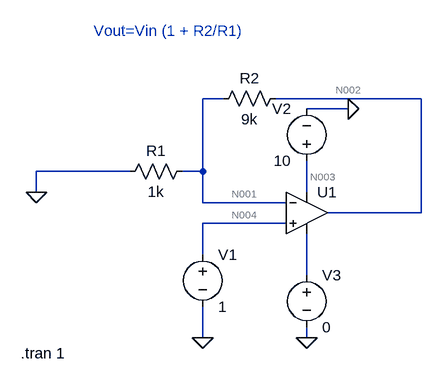
[diagram p0: schematic OPAMP_ORNEK.asc]
OPAMP_ORNEK.asc, the LTspice schematic file:
Version 4
SHEET 1 880 680
WIRE -16 -32 -48 -32
WIRE 288 -32 64 -32
WIRE 176 -16 112 -16
WIRE -160 80 -304 80
WIRE -48 80 -48 -32
WIRE -48 80 -80 80
WIRE -304 112 -304 80
WIRE 112 112 112 64
WIRE -48 128 -48 80
WIRE 80 128 -48 128
WIRE 288 144 288 -32
WIRE 288 144 144 144
WIRE 80 160 -48 160
WIRE -48 208 -48 160
WIRE 112 240 112 176
WIRE -48 336 -48 288
WIRE 112 336 112 320
FLAG -304 112 0
FLAG -48 336 0
FLAG 176 -16 0
FLAG 112 336 0
SYMBOL OpAmps\\UniversalOpAmp 112 144 R0
SYMATTR InstName U1
SYMBOL voltage -48 192 R0
SYMATTR InstName V1
SYMATTR Value 1
SYMBOL res -64 64 R90
WINDOW 0 0 56 VBottom 2
WINDOW 3 32 56 VTop 2
SYMATTR InstName R1
SYMATTR Value 1k
SYMBOL res 80 -48 R90
WINDOW 0 0 56 VBottom 2
WINDOW 3 32 56 VTop 2
SYMATTR InstName R2
SYMATTR Value 9k
SYMBOL voltage 112 80 R180
WINDOW 0 24 96 Left 2
WINDOW 3 24 16 Left 2
SYMATTR InstName V2
SYMATTR Value 10
SYMBOL voltage 112 224 R0
SYMATTR InstName V3
SYMATTR Value 0
TEXT -328 360 Left 2 !.tran 1
TEXT -216 -136 Left 2 ;Vout=Vin (1 + R2/R1)

The netlist it stands for:
* OPAMP_ORNEK.asc
XU1 N004 N001 N003 N005 N002 level1 Avol=1Meg GBW=10Meg Vos=0 En=0 Enk=0 In=0 Ink=0 Rin=500Meg  ; pins In+ In- V+ V- OUT
V1 N004 0 1
R1 N001 0 1k
R2 N002 N001 9k
V2 N003 0 10
V3 N005 0 0
.tran 1
* Vout=Vin (1 + R2/R1)
.lib UniversalOpAmp1.lib
.backanno
.end

* Results of the author's LTspice run, read from the files saved beside the schematic
* Operating Point, zero values left out:
*   V(n001) = 1 V
*   V(n004) = 1 V
*   V(n002) = 10 V
*   V(n003) = 10 V
*   I(R2) = 1 mA
*   I(R1) = 1 mA
*   I(V3) = 2 nA
*   I(V2) = -18 nA
*   I(V1) = 8 nA
*   Ix(u1:1) = -8 nA
*   Ix(u1:2) = -8 nA
*   Ix(u1:3) = 18 nA
*   Ix(u1:4) = -2 nA
*   Ix(u1:5) = -1 mA